# Altium schematic sheet Arduino_MEGA_2560-Rev3_1.SchDoc
size A2
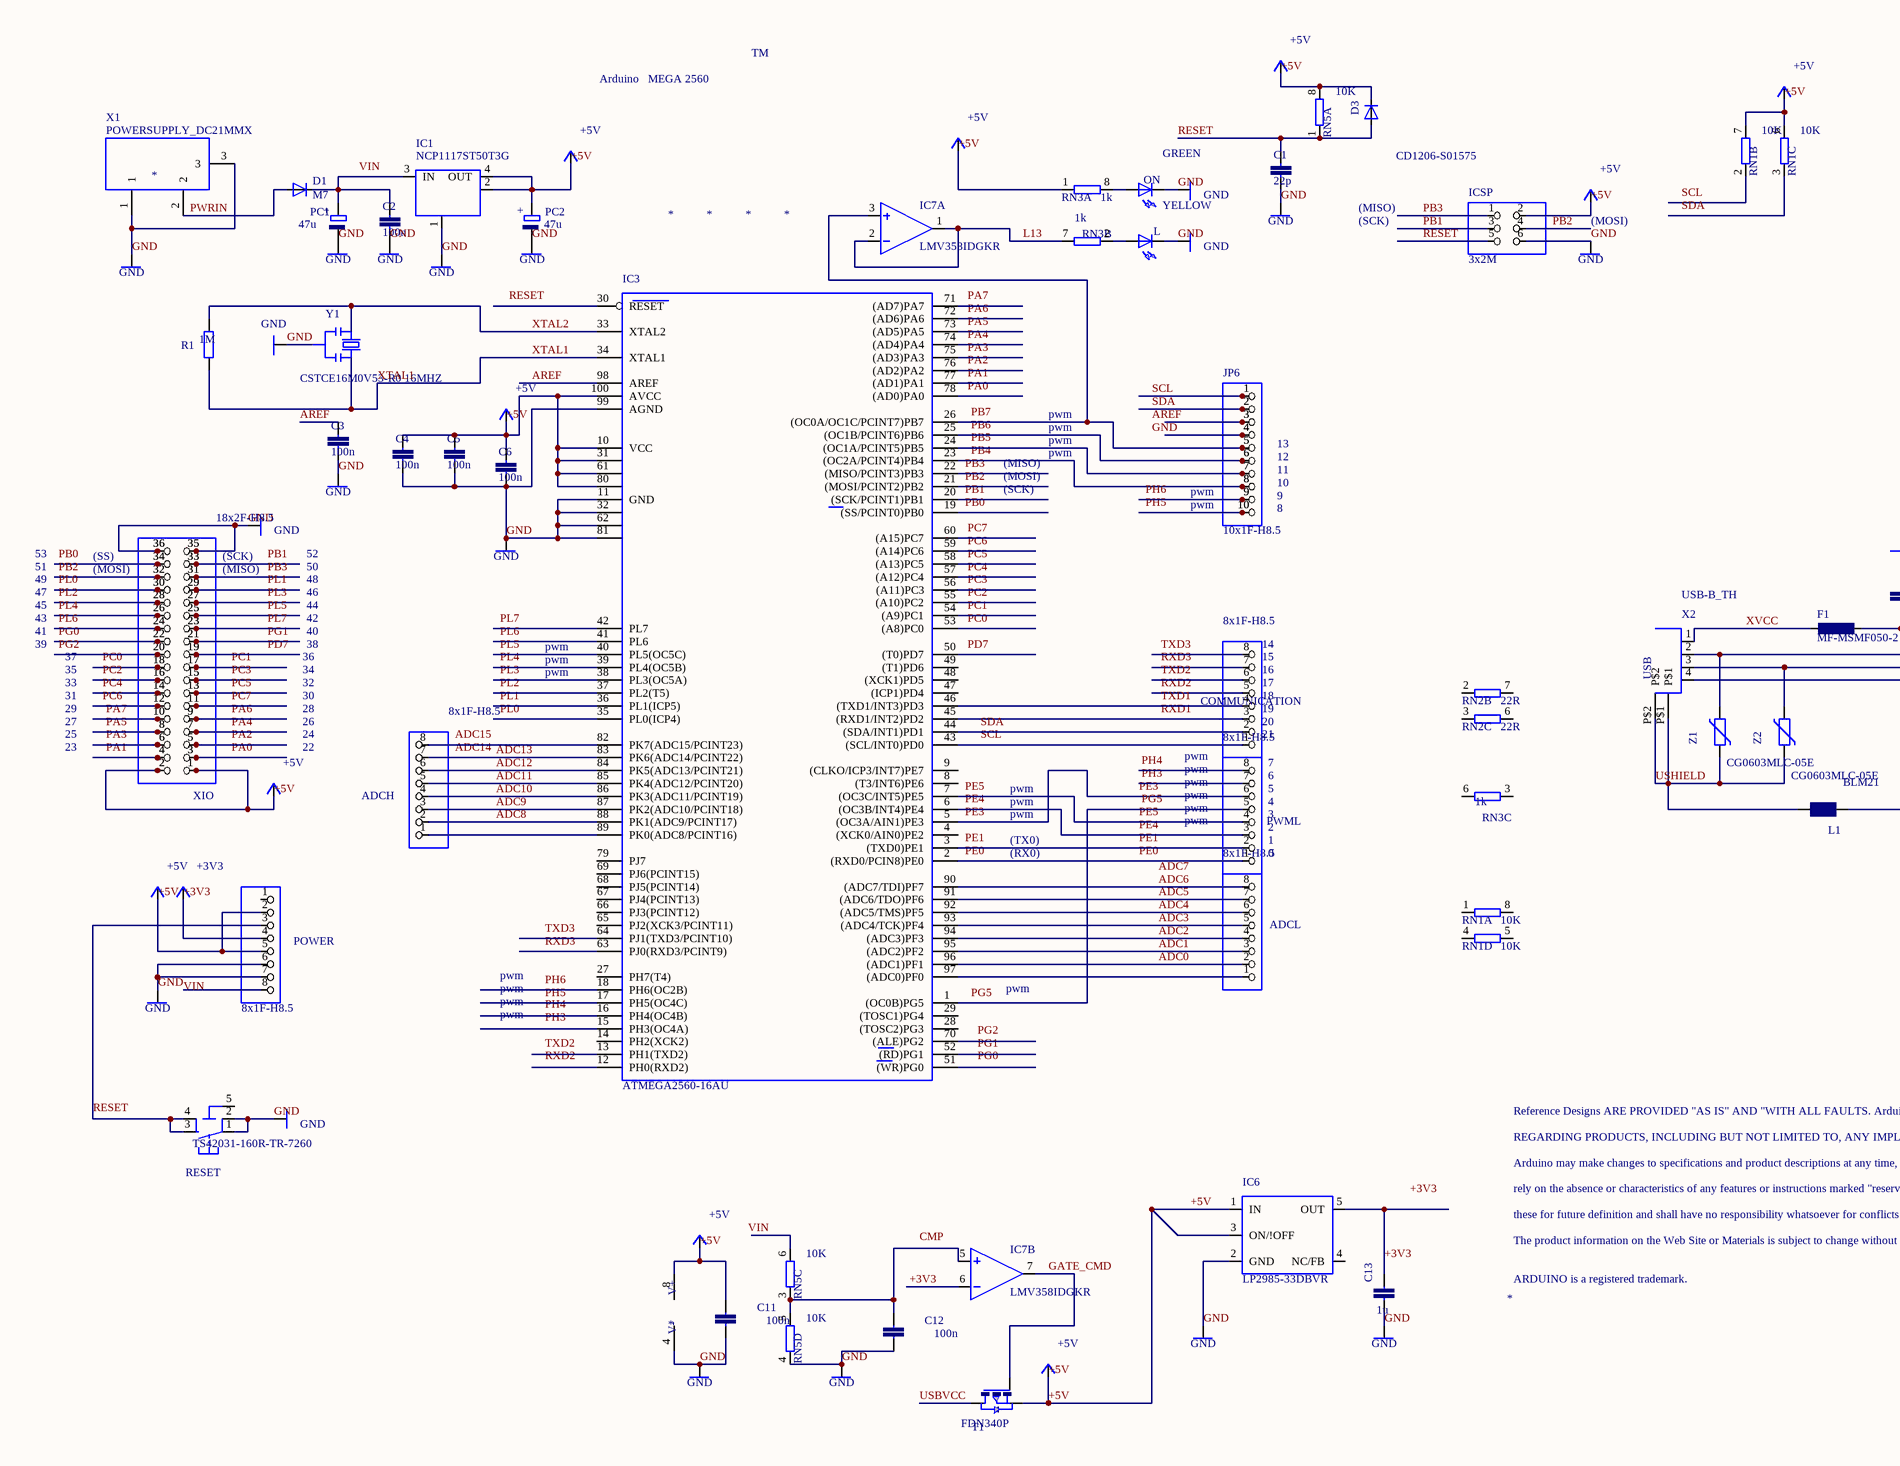
[diagram p0: Arduino_MEGA_2560-Rev3_1.SchDoc, left]
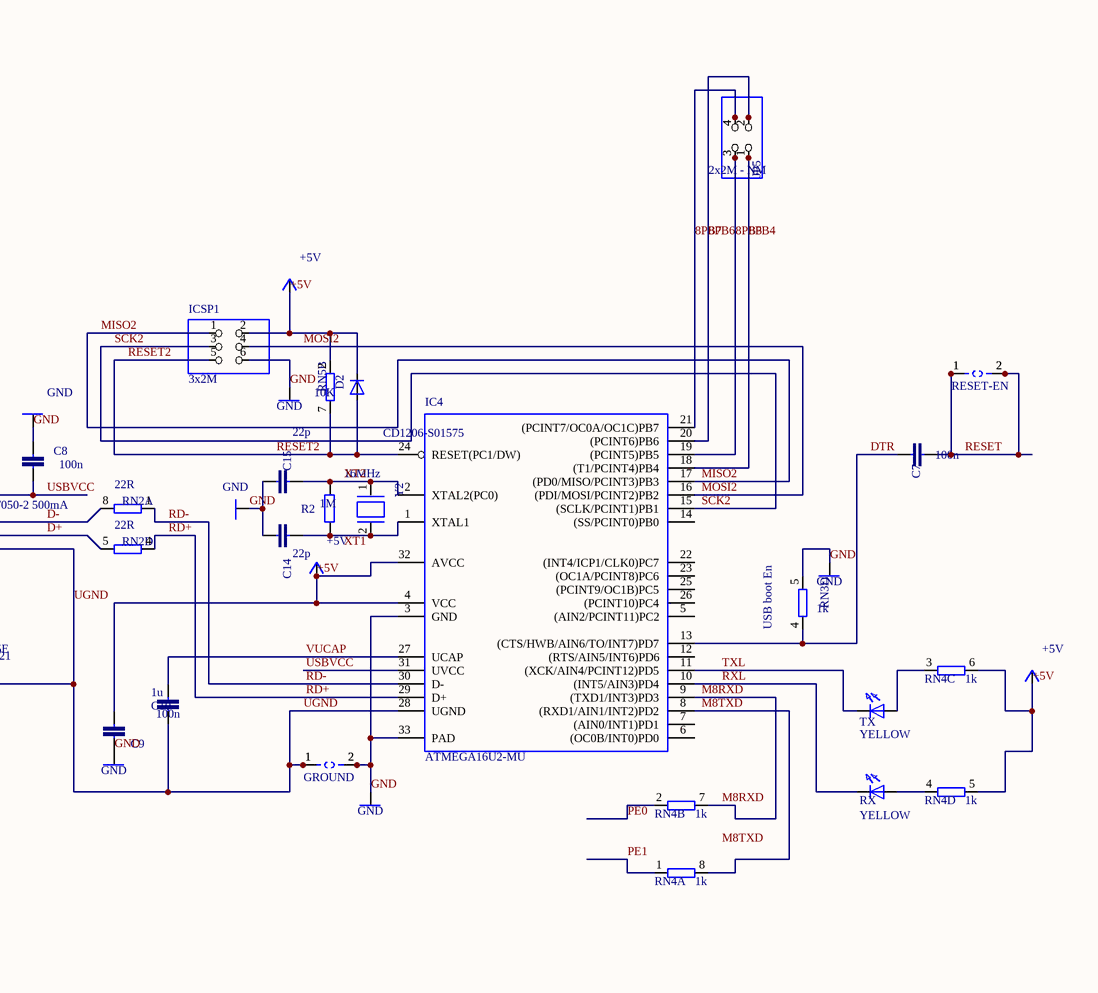
[diagram p1: Arduino_MEGA_2560-Rev3_1.SchDoc, right]

## Parts
+3V3  +3V3
ADCH  8x1F-H8.5  [1X08]
ADCL  8x1F-H8.5  [1X08]
C1  22p  [C0603-ROUND]
C2  100n  [C0603-ROUND]
C3  100n  [C0603-ROUND]
C4  100n  [C0603-ROUND]
C5  100n  [C0603-ROUND]
C6  100n  [C0603-ROUND]
C7  100n  [C0603-ROUND]
C8  100n  [C0603-ROUND]
C9  100n  [C0603-ROUND]
C10  1u  [C0603-ROUND]
C11  100n  [C0603-ROUND]
C12  100n  [C0603-ROUND]
C13  1u  [C0603-ROUND]
C14  22p  [C0603-ROUND]
C15  22p  [C0603-ROUND]
COMMUNICATION  8x1F-H8.5  [1X08]
D1  M7  [SMB]
D2  CD1206-S01575  [MINIMELF]
D3  CD1206-S01575  [MINIMELF]
F1  MF-MSMF050-2 500mA  [L1812]
FD1  *  [FIDUCIA-MOUNT]
FD2  *  [FIDUCIA-MOUNT]
FD3  *  [FIDUCIA-MOUNT]
FD4  *  [FIDUCIA-MOUNT]
GND1  GND
GND2  GND
GND3  GND
GND4  GND
GND5  GND
GND7  GND
GND8  GND
GND9  GND
GND10  GND
GND11  GND
GND12  GND
GND13  GND
GND14  GND
GND15  GND
GND16  GND
GND18  GND
GND19  GND
GND20  GND
GND22  GND
GND23  GND
GND24  GND
GND25  GND
GND26  GND
GND28  GND
GND30  GND
GROUND  (no value)  [SJ]
IC1  NCP1117ST50T3G  [SOT223]
IC3  ATMEGA2560-16AU  [TQFP100]
IC4  ATMEGA16U2-MU  [MLF32]
IC6  LP2985-33DBVR  [SOT23-DBV]
IC7  LMV358IDGKR  [MSOP08]  (parts A,B,C of 3)
ICSP  3x2M  [2X03]
ICSP1  3x2M  [2X03]
JP5  2x2M - NM  [2X02]
JP6  10x1F-H8.5  [1X10]
L  YELLOW  [CHIP-LED0805]
L1  BLM21  [0805]
ON  GREEN  [CHIP-LED0805]
P+1  +5V
P+2  +5V
P+3  +5V
P+4  +5V
P+5  +5V
P+7  +5V
P+8  +5V
P+9  +5V
P+10  +5V
P+11  +5V
P+12  +5V
P+13  +5V
P+14  +5V
PC1  47u  [PANASONIC_D]
PC2  47u  [PANASONIC_D]
POWER  8x1F-H8.5  [1X08]
PWML  8x1F-H8.5  [1X08]
R1  1M  [R0603-ROUND]
R2  1M  [R0603-ROUND]
RESET  TS42031-160R-TR-7260  [TS42]
RESET-EN  (no value)  [SJ]
RN1  10K  [CAT16]  (parts A,B,C,D of 4)
RN2  22R  [CAY16]  (parts A,B,C,D of 4)
RN3  1k  [CAY16]  (parts A,B,C,D of 4)
RN4  1k  [CAY16]  (parts A,B,C,D of 4)
RN5  10K  [CAT16]  (parts A,B,C,D of 4)
RX  YELLOW  [CHIP-LED0805]
T1  FDN340P  [SOT-23]
TX  YELLOW  [CHIP-LED0805]
U$1  *  [DISCLAIMER]
X1  *  [POWERSUPPLY_DC-21MM]
X2  USB-B_TH  [PN61729]
XIO  18x2F-H8.5  [2X18]
Y1  CSTCE16M0V53-R0 16MHZ  [RESONATOR]
Y2  16MHz  [QS]
Z1  CG0603MLC-05E  [CT/CN0603]
Z2  CG0603MLC-05E  [CT/CN0603]

## Nets
8PB4: IC4.18((T1/PCINT4)PB4) JP5.1
8PB5: IC4.19((PCINT5)PB5) JP5.3
8PB6: IC4.20((PCINT6)PB6) JP5.2
8PB7: IC4.21((PCINT7/OC0A/OC1C)PB7) JP5.4
+3V3: +3V3.0(+3V3) C13.2 IC6.5(OUT) IC7.6(-IN) POWER.4
+5V: C4.1 C5.1 C6.1 C9.1 C11.2 D2.C D3.C IC1.2(OUT@1) IC1.4(OUT) IC3.10(VCC) IC3.31(VCC1) IC3.61(VCC2) IC3.80(VCC3) IC3.100(AVCC) IC4.4(VCC) IC4.32(AVCC) IC6.1(IN) IC6.3(ON/!OFF) IC7.8(V+) ICSP.2 ICSP1.2 P+1.0(+5V) P+2.0(+5V) P+3.0(+5V) P+4.0(+5V) P+5.0(+5V) P+7.0(+5V) P+8.0(+5V) P+9.0(+5V) P+10.0(+5V) P+11.0(+5V) P+12.0(+5V) P+13.0(+5V) P+14.0(+5V) PC2.+ POWER.2 POWER.5 RN1.6 RN1.7 RN3.1 RN4.5 RN4.6 RN5.2 RN5.8 T1.2(S) XIO.1 XIO.2
ADC0: ADCL.2 IC3.96((ADC1)PF1)
ADC1: ADCL.3 IC3.95((ADC2)PF2)
ADC2: ADCL.4 IC3.94((ADC3)PF3)
ADC3: ADCL.5 IC3.93((ADC4/TCK)PF4)
ADC4: ADCL.6 IC3.92((ADC5/TMS)PF5)
ADC5: ADCL.7 IC3.91((ADC6/TDO)PF6)
ADC6: ADCL.8 IC3.90((ADC7/TDI)PF7)
ADC8: ADCH.2 IC3.88(PK1(ADC9/PCINT17))
ADC9: ADCH.3 IC3.87(PK2(ADC10/PCINT18))
ADC10: ADCH.4 IC3.86(PK3(ADC11/PCINT19))
ADC11: ADCH.5 IC3.85(PK4(ADC12/PCINT20))
ADC12: ADCH.6 IC3.84(PK5(ADC13/PCINT21))
ADC13: ADCH.7 IC3.83(PK6(ADC14/PCINT22))
AREF: C3.1 IC3.98(AREF)
D+: RN2.5 X2.3 Z2.2
D-: RN2.8 X2.2 Z1.2
DTR: C7.1 IC4.13((CTS/HWB/AIN6/TO/INT7)PD7) RN3.4
GATE_CMD: IC7.7(OUT) T1.3(G)
GND: C1.2 C2.2 C3.2 C4.2 C5.2 C6.2 C8.2 C9.2 C11.1 C12.1 C13.1 C14.2 C15.2 GND1.0(GND) GND2.0(GND) GND3.0(GND) GND4.0(GND) GND5.0(GND) GND7.0(GND) GND8.0(GND) GND9.0(GND) GND10.0(GND) GND11.0(GND) GND12.0(GND) GND13.0(GND) GND14.0(GND) GND15.0(GND) GND16.0(GND) GND18.0(GND) GND19.0(GND) GND20.0(GND) GND22.0(GND) GND23.0(GND) GND24.0(GND) GND25.0(GND) GND26.0(GND) GND28.0(GND) GND30.0(GND) GROUND.2 IC1.1(GND/ADJ) IC3.11(GND) IC3.32(GND1) IC3.62(GND2) IC3.81(GND3) IC3.99(AGND) IC4.3(GND) IC4.33(PAD) IC6.2(GND) IC7.4(V-) ICSP.6 ICSP1.6 L.C ON.C PC1.- PC2.- POWER.6 POWER.7 RESET.1 RESET.2 RN3.5 RN5.4 X1.1 X1.3 XIO.35 XIO.36 Y1.2
L13: IC7.1(OUT) IC7.2(-IN) RN3.7
M8RXD: IC4.9((TXD1/INT3)PD3) RN4.7
M8TXD: IC4.8((RXD1/AIN1/INT2)PD2) RN4.8
MISO2: IC4.17((PD0/MISO/PCINT3)PB3) ICSP1.1
MOSI2: IC4.16((PDI/MOSI/PCINT2)PB2) ICSP1.4
PB1: ICSP.3
PB2: ICSP.4
PB3: ICSP.1
PE0: RN4.2
PE1: RN4.1
PWRIN: D1.A X1.2
RD+: IC4.29(D+) RN2.4
RD-: IC4.30(D-) RN2.1
RESET: C1.1 C7.2 D3.A ICSP.5 POWER.3 RESET.3 RESET.4 RESET-EN.1 RESET-EN.2 RN5.1
RESET2: D2.A IC4.24(RESET(PC1/DW)) ICSP1.5 RN5.7
RXL: IC4.10((INT5/AIN3)PD4) RX.C
SCK2: IC4.15((SCLK/PCINT1)PB1) ICSP1.3
SCL: JP6.1
SDA: JP6.2
TXL: IC4.11((XCK/AIN4/PCINT12)PD5) TX.C
UGND: C10.2 GROUND.1 IC4.28(UGND) L1.1 X2.4
USBVCC: C8.1 F1.1 IC4.31(UVCC) T1.1(D)
USHIELD: L1.2 X2.P$1 X2.P$2 Z1.1 Z2.1
VUCAP: C10.1 IC4.27(UCAP)
XT2: C15.1 IC4.2(XTAL2(PC0)) R2.2 Y2.1
XTAL1: IC3.34(XTAL1) R1.1 Y1.3
XTAL2: IC3.33(XTAL2) R1.2 Y1.1
XVCC: F1.2 X2.1
NetADCH_1: ADCH.1 IC3.89(PK0(ADC8/PCINT16))
NetADCH_8: ADCH.8 IC3.82(PK7(ADC15/PCINT23))
NetADCL_1: ADCL.1 IC3.97((ADC0)PF0)
NetC2_1: C2.1 D1.C IC1.3(IN) PC1.+
NetC12_2: C12.2 IC7.5(+IN) RN5.3 RN5.5
NetC14_1: C14.1 IC4.1(XTAL1) R2.1 Y2.2
NetCOMMUNICATION_1: COMMUNICATION.1 IC3.43((SCL/INT0)PD0)
NetCOMMUNICATION_2: COMMUNICATION.2 IC3.44((SDA/INT1)PD1)
NetCOMMUNICATION_3: COMMUNICATION.3 IC3.45((RXD1/INT2)PD2)
NetCOMMUNICATION_4: COMMUNICATION.4 IC3.46((TXD1/INT3)PD3)
NetIC3_1: IC3.1((OC0B)PG5) PWML.5
NetIC3_2: IC3.2((RXD0/PCIN8)PE0) PWML.1
NetIC3_3: IC3.3((TXD0)PE1) PWML.2
NetIC3_5: IC3.5((OC3A/AIN1)PE3) PWML.6
NetIC3_6: IC3.6((OC3B/INT4)PE4) PWML.3
NetIC3_7: IC3.7((OC3C/INT5)PE5) PWML.4
NetIC3_23: IC3.23((OC2A/PCINT4)PB4) JP6.8
NetIC3_24: IC3.24((OC1A/PCINT5)PB5) JP6.7
NetIC3_25: IC3.25((OC1B/PCINT6)PB6) JP6.6
NetIC3_26: IC3.26((OC0A/OC1C/PCINT7)PB7) IC7.3(+IN) JP6.5
NetL_A: L.A RN3.2
NetON_A: ON.A RN3.8
NetRN4_3: RN4.3 TX.A
NetRN4_4: RN4.4 RX.A

Not connected (* = marked no-connect by the designer): COMMUNICATION 5 6 7 8; IC3 4((XCK0/AIN0)PE2) 8((T3/INT6)PE6) 9((CLKO/ICP3/INT7)PE7) 12(PH0(RXD2)) 13(PH1(TXD2)) 14(PH2(XCK2)) 15(PH3(OC4A)) 16(PH4(OC4B)) 17(PH5(OC4C)) 18(PH6(OC2B)) 19((SS/PCINT0)PB0) 20((SCK/PCINT1)PB1) 21((MOSI/PCINT2)PB2) 22((MISO/PCINT3)PB3) 27(PH7(T4)) 28((TOSC2)PG3) 29((TOSC1)PG4) 30(RESET) 35(PL0(ICP4)) 36(PL1(ICP5)) 37(PL2(T5)) 38(PL3(OC5A)) 39(PL4(OC5B)) 40(PL5(OC5C)) 41(PL6) 42(PL7) 47((ICP1)PD4) 48((XCK1)PD5) 49((T1)PD6) 50((T0)PD7) 51((WR)PG0) 52((RD)PG1) 53((A8)PC0) 54((A9)PC1) 55((A10)PC2) 56((A11)PC3) 57((A12)PC4) 58((A13)PC5) 59((A14)PC6) 60((A15)PC7) 63(PJ0(RXD3/PCINT9)) 64(PJ1(TXD3/PCINT10)) 65(PJ2(XCK3/PCINT11)) 66(PJ3(PCINT12)) 67(PJ4(PCINT13)) 68(PJ5(PCINT14)) 69(PJ6(PCINT15)) 70((ALE)PG2) 71((AD7)PA7) 72((AD6)PA6) 73((AD5)PA5) 74((AD4)PA4) 75((AD3)PA3) 76((AD2)PA2) 77((AD1)PA1) 78((AD0)PA0) 79(PJ7); IC4 5((AIN2/PCINT11)PC2) 6((OC0B/INT0)PD0) 7((AIN0/INT1)PD1) 12((RTS/AIN5/INT6)PD6) 14((SS/PCINT0)PB0) 22((INT4/ICP1/CLK0)PC7) 23((OC1A/PCINT8)PC6) 25((PCINT9/OC1B)PC5) 26((PCINT10)PC4); IC6 4(NC/FB); JP6 3 4 9 10; POWER 1 8; PWML 7 8; RESET 5(5-GND); RN1 1 2(1) 3(1) 4(1) 5(2) 8(2); RN2 2(1) 3(1) 6(2) 7(2); RN3 3(1) 6(2); RN5 6(2); XIO 3 4 5 6 7 8 9 10 11 12 13 14 15 16 17 18 19 20 21 22 23 24 25 26 27 28 29 30 31 32 33 34

## Notes on the sheet
- Arduino   MEGA 2560
- TM
- (SCK)
- (MISO)
- (MOSI)
- pwm
- (near JP6) 10
- (near JP6) 11
- (near JP6) 12
- (near JP6) 13
- (near JP6) pwm
- (near JP6) 8
- (near JP6) 9
- 51
- 53
- 49
- 47
- 45
- (SS)
- (near XIO) (MOSI)
- 52
- 50
- 48
- 46
- 44
- 43
- 41
- 39
- 35
- 37
- 34
- 36
- 42
- 40
- 38
- (near COMMUNICATION) 15
- (near COMMUNICATION) 16
- (near COMMUNICATION) 14
- 25
- 27
- 29
- 31
- 33
- (near P+12) 24
- 26
- 28
- 30
- 32
- (near COMMUNICATION) 17
- (near COMMUNICATION) 18
- (near COMMUNICATION) 19
- (near COMMUNICATION) 20
- (near COMMUNICATION) 21
- 23
- (near P+12) 22
- (near PWML) 4
- (near PWML) 5
- (near PWML) 6
- 7
- (near RN3) USB boot En
- (TX0)
- (RX0)
- (near PWML) 0
- (near PWML) 1
- (near PWML) 2
- (near PWML) 3
- Labels drawn without touching a wire or pin: +3V3, ADC7, ADC14, ADC15, AREF, CMP, GND, M8TXD, PA0, PA1, PA2, PA3, PA4, PA5, PA6, PA7, PB0, PB1, PB2, PB3, PB4, PB5, PB6, PB7, PC0, PC1, PC2, PC3, PC4, PC5, PC6, PC7, PD7, PE0, PE1, PE3, PE4, PE5, PG0, PG1, PG2, PG5, PH3, PH4, PH5, PH6, PL0, PL1, PL2, PL3, PL4, PL5, PL6, PL7, RESET, RXD1, RXD2, RXD3, SCL, SDA, TXD1, TXD2, TXD3, VIN, XT1
- (in symbol DISCLAIMER) Reference Designs ARE PROVIDED "AS IS" AND "WITH ALL FAULTS. Arduino DISCLAIMS ALL OTHER WARRANTIES, EXPRESS OR IMPLIED,; REGARDING PRODUCTS, INCLUDING BUT NOT LIMITED TO, ANY IMPLIED WARRANTIES OF MERCHANTABILITY OR FITNESS FOR A PARTICULAR PURPOSE; Arduino may make changes to specifications and product descriptions at any time, without notice. The Customer must not; rely on the absence or characteristics of any features or instructions marked "reserved" or "undefined." Arduino reserves; these for future definition and shall have no responsibility whatsoever for conflicts or incompatibilities arising from future changes to them.; The product information on the Web Site or Materials is subject to change without notice. Do not finalize a design with this information.; ARDUINO is a registered trademark.
- (in symbol PN61729) USB

## Library data of the parts
ADCH ADCL COMMUNICATION POWER PWML = PINHD-1X8
C1-C15 = C-EU0603-RND
D1 = DIODE-SMB
D2 D3 = DIODE-MINIMELF
F1 = L-EUL1812
FD1-FD4 = FIDUCIALMOUNT
GROUND RESET-EN = SJ
IC1 = MC33269ST-3.3T3
IC3 = ATMEGA25602560-16AU
IC6 = LP2985-XXDBVR33
IC7 = LMV358MMX
ICSP ICSP1 = PINHD-2X3
JP5 = PINHD-2X2
JP6 = PINHD-1X10_ARD
L ON RX TX = LEDCHIP-LED0805
L1 = WE-CBF_0805
PC1 PC2 = CPOL-EUD
R1 R2 = R-EU_R0603
RESET = TS42
RN1 RN5 = 4R-NCAT16
RN2-RN4 = 4R-NCAY16
T1 = PMOSSOT23
U$1 = DISCLAIMER
X1 = POWERSUPPLY_DC21MMX
X2 = PN61729
XIO = PINHD-2X18
Y1 = RESONATORMU
Y2 = XTAL/S
Z1 Z2 = VARISTORCN0603